# Altium schematic sheet Power.SchDoc
size B; SheetNumber: 1; SheetTotal: 5
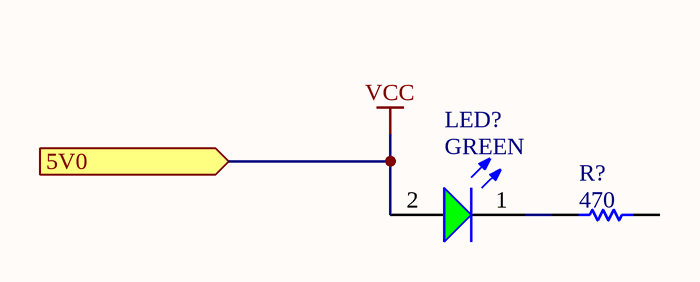
[diagram p0: Power.SchDoc]

## Parts
LED?  GREEN  [WL-SMCW_0603_150060xx75000]
R?  470  [RESC1005X40X25LL05T10]

## Ports
5V0 (in)

## Nets
VCC: LED?.2(A) ; port 5V0
NetLED?_1: LED?.1(K) R?.1

Not connected (* = marked no-connect by the designer): R? 2

## Library data of the parts
LED? = CMP-1426-00006-7: WURTH ELEKTRONIK - 150060VS75000 - LED, Green, SMD, 0603, 30 mA, 2 V, 570 nm; Reverse Voltage: 5V; Power Dissipation: 72mW; Dominant Wavelength: 570nm; Peak Wavelength: 572nm; Forward Current: 100mA; Forward Voltage: 2V; Lens Style: Clear, Rectangular; Test Current: 20mA; Max Junction Temperature (Tj): 95°C; Viewing Angle: 140°; Luminous Intensity: 40mcd; Height: 700µm; Width: 800µm; Length: 1.6mm; Mount: Surface Mount; Min Operating Temperature: -40°C; Max Reverse Voltage (DC): 5V; Case Code (Imperial): 0603; Wavelength: 570nm; Color: Green; REACH SVHC: Unknown; RoHS: Compliant; Max Operating Temperature: 85°C; Packaging: Tape and Reel; Case/Package: 0603; Number of Pins: 2; Case Code (Metric): 1608
R? = CMP-1011-00066-2: Part Number: RC0402JR-07470RL; Manufacturer: Yageo / Phycomp